# Altium project PCB2.PrjPcb
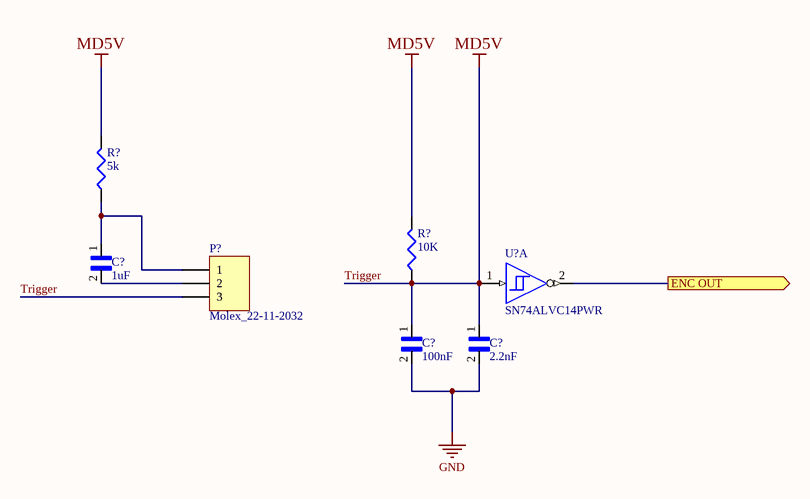
[diagram p0: Main Encoder.SchDoc]
9 sheets, 38 parts. Net scope: hierarchical (ports join the sheet entries above them; power ports are global).
Sheets:
  Main Encoder.SchDoc
  Top Level Hierarchy.SchDoc
    U_MCU Header = MCU Header.SchDoc
    U_CAN_Bus = CAN_Bus.SchDoc
    U_DAC = DAC.SchDoc
    U_LCD = LCD.SchDoc
    U_RS232 = RS232.SchDoc
    U_Servo Header = Servo Header.SchDoc
    U_Limit Switches = Limit Switches.SchDoc

## Sheet Main Encoder.SchDoc: Encoder
size B; Engineer: Kyle Dick; Revision: 1; SheetNumber: 12; SheetTotal: 12

### Parts
(Parts that share a designator on the sheet are numbered #1, #2 ... from top to bottom, then left to right.)
C?#1  1uF  [10 uF Cap]
C?#2  100nF  [10 uF Cap]
C?#3  2.2nF  [10 uF Cap]
P?#1  Molex_22-11-2032  [MOLEX_22-11-2032]
R?#1  5k  [RESC2112X05M]
R?#2  10K  [RESC2112X05M]
U?  SN74ALVC14PWR  [PW0014A_N]  (part A of 7)

### Ports
ENC OUT (out)

### Nets
GND: C?#2.2 C?#3.2
Trigger: C?#2.1 C?#3.1 P?#1.3 R?#1.2 R?#2.1 R?#2.2 U?.1(1A)  [also labelled MD5V]
NetC?#1_1: C?#1.1 P?#1.1 R?#1.1
NetC?#1_2: C?#1.2 P?#1.2
NetU?_2: U?.2(~{1Y}) ; port ENC OUT

### Notes on the sheet
- ESE
- is the sole property of ESE. Any reproduction
- The Information Contained in this drawing
- Schematic P/N and Name
- Sheet Name
- 850 Fountain St. S.
- Cambridge, ON N3H 0A8
- Canada
- Approved
- in part or in whole without the written
- permission of ESE is strictly prohibited.
- APPROVALS
- DATE
- Size
- Scale
- B
- NTS
- Bare PCB P/N
- Date
- Sheet
- Rev.
- Checked
- Created
- of

### Library data of the parts
C?#1 = Capacitor 1uF: Ceramic Capacitor 1210; MF: Samsung Electro-Mechanics; MP: CL32A106KBJNNNE; Check_prices: https://www.snapeda.com/parts/CL32A106KBJNNNE/Samsung%20Electro-Mechanics/view-part/3598300/?ref=eda; Value: *; SnapEDA_Link: https://www.snapeda.com/parts/CL32A106KBJNNNE/Samsung%20Electro-Mechanics/view-part/3598300/?ref=snap; Package: 1210 Samsung; Availability: Unavailable; Price: None; Supplier 1: Arrow Electronics; Supplier Part Number 1: CL32B105KCJNNNE
C?#2 = Capacitor 0.1uF: Ceramic Capacitor 1210; MF: Samsung Electro-Mechanics; MP: CL32A106KBJNNNE; Check_prices: https://www.snapeda.com/parts/CL32A106KBJNNNE/Samsung%20Electro-Mechanics/view-part/3598300/?ref=eda; Value: *; SnapEDA_Link: https://www.snapeda.com/parts/CL32A106KBJNNNE/Samsung%20Electro-Mechanics/view-part/3598300/?ref=snap; Package: 1210 Samsung; Availability: Unavailable; Price: None; Supplier 1: Mouser; Supplier Part Number 1: 80-C1210C104K1R
C?#3 = Capacitor 2.2nF: Ceramic Capacitor 1210; MF: Samsung Electro-Mechanics; MP: CL32A106KBJNNNE; Check_prices: https://www.snapeda.com/parts/CL32A106KBJNNNE/Samsung%20Electro-Mechanics/view-part/3598300/?ref=eda; Value: *; SnapEDA_Link: https://www.snapeda.com/parts/CL32A106KBJNNNE/Samsung%20Electro-Mechanics/view-part/3598300/?ref=snap; Package: 1210 Samsung; Availability: Unavailable; Price: None; Supplier 1: Mouser; Supplier Part Number 1: 80-C1210C222K1HAUTO
P?#1 = Molex_22-11-2032: CONN HEADER 3POS .100 VERT GOLD; MPN: 0022112032; PN: WM2701-ND; URL: http://www.digikey.ca/product-detail/en/0022112032/WM2701-ND
R?#1 = Resistor 5k: 5k 1206 smd; Supplier: Arrow Electronics; Supplier Part Number: RMCF1206FT10K0; Supplier 1: Arrow Electronics; Supplier Part Number 1: RMCF1206FT10K0
R?#2 = Resistor 10k: 10k 1206 smd; Supplier: Arrow Electronics; Supplier Part Number: RMCF1206FT10K0; Supplier 1: Arrow Electronics; Supplier Part Number 1: RMCF1206FT10K0
U? = CMP-1615-01048-3: Hex Schmitt-Trigger Inverter, PW0014A, LARGE T&R; Manufacturer: Texas Instruments; Schmitt Trigger: Yes; Technology Family: ALVC; VCC(Min)(V): 2.3; Output Drive (IOL/IOH)(Max)(mA): -24/24; ICC @ Nom Voltage(Max)(mA): 0.01; Input Type: TTL; Output Type: CMOS; tpd @ Nom Voltage(Max)(ns): 3.7,3.9,3.4; VCC(Max)(V): 3.6; Bits(#): 6; F @ Nom Voltage(Max)(Mhz): 100; Rating: Catalog; Voltage(Nom)(V): 2.5,2.7,3.3; Code_JEDEC: MO-153; Operating Temperature Range(C): -40 to 85; DatasheetVersion: SCES107H; PackageReference: PW0014A; Generic Part Number: SN74ALVC14

## Sheet Top Level Hierarchy.SchDoc: Top Level Design
size B; Date: 24-02-02; CheckedBy: Jude THibeault; Author: Kyle Dick; Engineer: Kyle DIck; Revision: 0; SheetNumber: 1; SheetTotal: 10
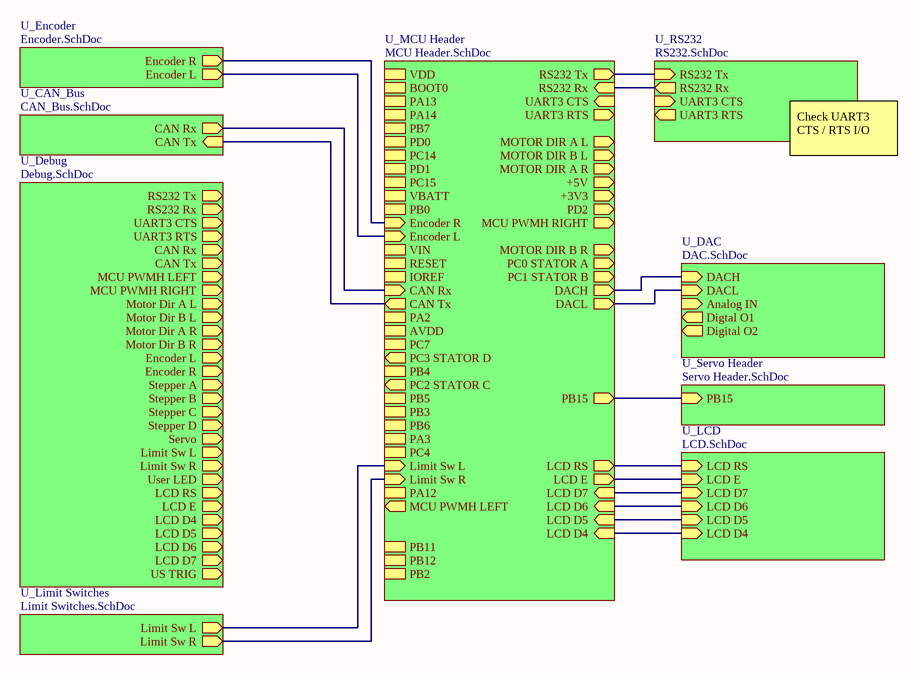
[diagram p1: Top Level Hierarchy.SchDoc]

### Sub-sheets
U_CAN_Bus = CAN_Bus.SchDoc: CAN Rx (out), CAN Tx (in)
U_DAC = DAC.SchDoc: DACH (in), DACL (in), Digtal O1 (out), Digital O2 (out), Analog IN (in)
U_Debug = Debug.SchDoc (file not in this document): RS232 Tx (out), RS232 Rx (out), UART3 CTS (out), UART3 RTS (out), CAN Rx (out), CAN Tx (out), MCU PWMH LEFT (out), MCU PWMH RIGHT (out), Motor Dir A L (out), Motor Dir B L (out), Motor Dir A R (out), Motor Dir B R (out), Encoder L (out), Encoder R (out), Stepper A (out), Stepper B (out), Stepper C (out), Stepper D (out), Servo (out), Limit Sw L (out), Limit Sw R (out), User LED (out), LCD RS (out), LCD E (out), LCD D4 (out), LCD D5 (out), LCD D6 (out), LCD D7 (out), US TRIG (out)
U_Encoder = Encoder.SchDoc (file not in this document): Encoder L (out), Encoder R (out)
U_LCD = LCD.SchDoc: LCD RS (in), LCD E (in), LCD D7 (in), LCD D6 (in), LCD D5 (in), LCD D4 (in)
U_Limit Switches = Limit Switches.SchDoc: Limit Sw L (out), Limit Sw R (out)
U_MCU Header = MCU Header.SchDoc: PC0 STATOR A (out), PC1 STATOR B (out), PC2 STATOR C (out), PC3 STATOR D (out), VDD, MCU PWMH LEFT (out), BOOT0, MOTOR DIR A L (out), PA13, PA14, PB7, MOTOR DIR B L (out), PD0, PC14, PD1, PC15, VBATT, PB0, Encoder R (in), Encoder L (in), VIN, +5V (out), +3V3 (out), RESET, IOREF, PD2 (out), MCU PWMH RIGHT (out), LCD D6 (in), PA2, CAN Tx (out), MOTOR DIR B R (out), AVDD, CAN Rx (in), LCD RS (out), PC7, LCD E (out), LCD D5 (in), PB4, LCD D4 (in), PB5, RS232 Tx (out), PB3, PB6, PA3, PC4, Limit Sw L (in), MOTOR DIR A R (out), Limit Sw R (in), PA12, LCD D7 (in), PB12, PB2, UART3 CTS (in), RS232 Rx (in), UART3 RTS (out), PB15 (out), PB11, DACL (out), DACH (out)
U_RS232 = RS232.SchDoc: RS232 Tx (in), RS232 Rx (out), UART3 CTS (in), UART3 RTS (out)
U_Servo Header = Servo Header.SchDoc: PB15 (in)

### Nets
IC5V: sheet U_MCU Header/LCD E, sheet U_LCD/LCD E
NetCRXD_2: sheet U_MCU Header/CAN Rx, sheet U_CAN_Bus/CAN Rx
NetP?#2_28: sheet U_MCU Header/Encoder L, sheet U_Encoder/Encoder L
NetP?#2_30: sheet U_MCU Header/Encoder R, sheet U_Encoder/Encoder R
NetP?#2_32: sheet U_MCU Header/DACL, sheet U_DAC/DACL
NetP?#3_4: sheet U_MCU Header/Limit Sw R, sheet U_Limit Switches/Limit Sw R
NetP?#3_5: sheet U_MCU Header/CAN Tx, sheet U_CAN_Bus/CAN Tx
NetP?#3_6: sheet U_MCU Header/Limit Sw L, sheet U_Limit Switches/Limit Sw L
NetP?#3_11: sheet U_MCU Header/DACH, sheet U_DAC/DACH
NetP?#3_13: sheet U_MCU Header/LCD RS, sheet U_LCD/LCD RS
NetP?#3_14: sheet U_MCU Header/LCD D7, sheet U_LCD/LCD D7
NetP?#3_21: sheet U_MCU Header/LCD D5, sheet U_LCD/LCD D5
NetP?#3_23: sheet U_MCU Header/LCD D4, sheet U_LCD/LCD D4
NetP?#3_24: sheet U_MCU Header/RS232 Rx, sheet U_RS232/RS232 Rx
NetP?#3_25: sheet U_MCU Header/RS232 Tx, sheet U_RS232/RS232 Tx
NetP?#3_26: sheet U_MCU Header/PB15, sheet U_Servo Header/PB15
NetP?#3_33: sheet U_MCU Header/LCD D6, sheet U_LCD/LCD D6

### Notes on the sheet
- Check UART3 CTS / RTS I/O
- ESE
- is the sole property of ESE. Any reproduction
- The Information Contained in this drawing
- Schematic P/N and Name
- Sheet Name
- 850 Fountain St. S.
- Cambridge, ON N3H 0A8
- Canada
- Approved
- in part or in whole without the written
- permission of ESE is strictly prohibited.
- APPROVALS
- DATE
- Size
- Scale
- B
- NTS
- Bare PCB P/N
- Date
- Sheet
- Rev.
- Checked
- Created
- of

## Sheet MCU Header.SchDoc: Nucleo Header Pin Assignment
size B; Date: 24-01-27; CheckedBy: Jude Thibeault; Author: Kyle Dick; DrawnBy: Kyle Dick; Engineer: Kyle Dick; Revision: 3; SheetNumber: 4; SheetTotal: 11
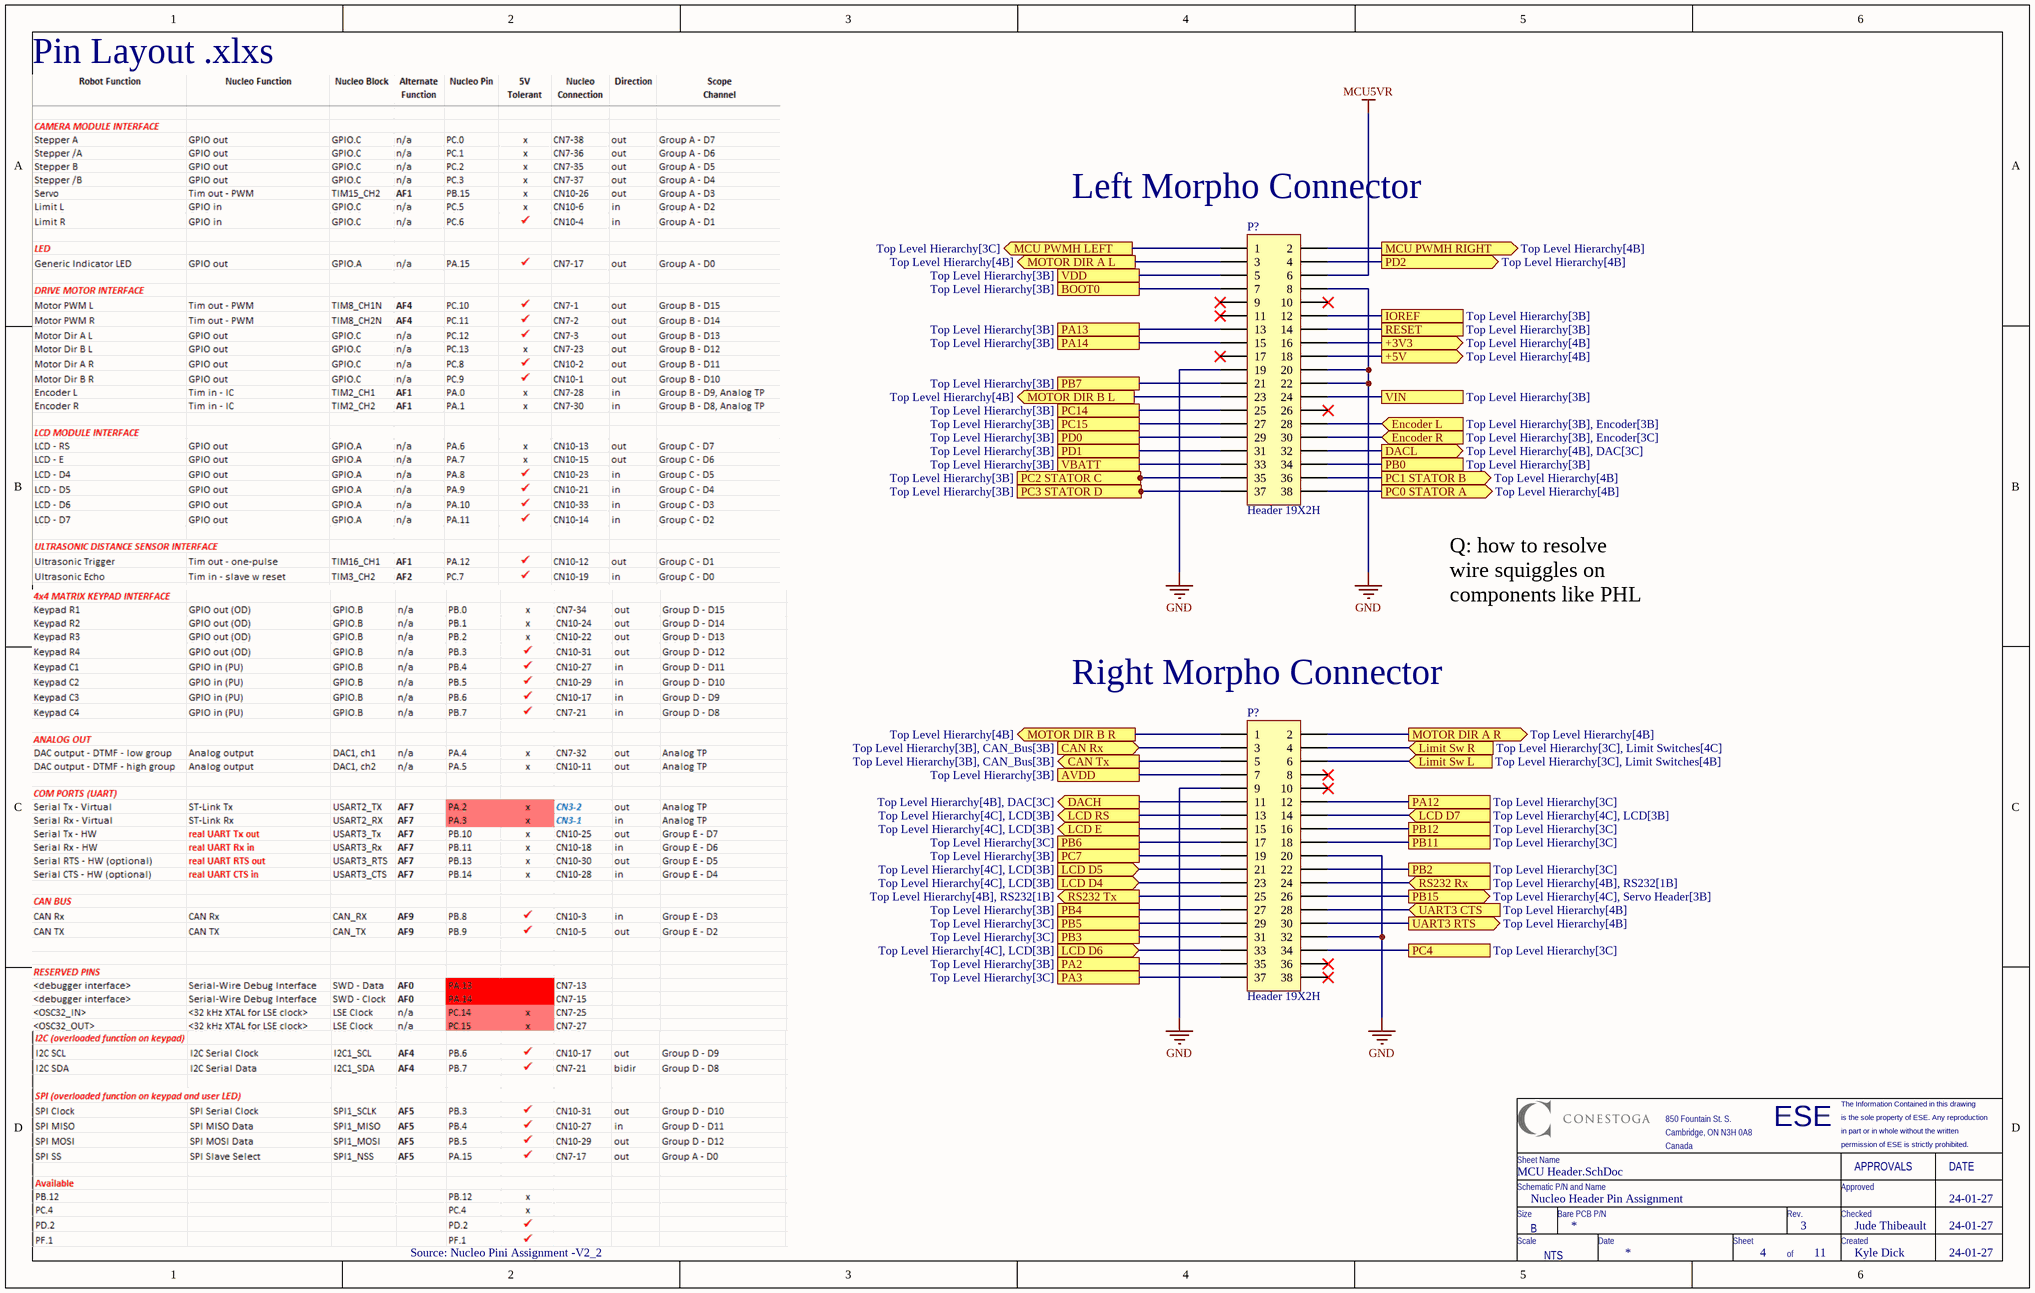
[diagram p2: MCU Header.SchDoc]

### Parts
(Parts that share a designator on the sheet are numbered #1, #2 ... from top to bottom, then left to right.)
P?#2  Header 19X2H  [Model Name]
P?#3  Header 19X2H  [PPPC192LFBN-RC]

### Ports
+3V3 (out, see Top Level Hierarchy[4B]), +5V (out, see Top Level Hierarchy[4B]), AVDD (see Top Level Hierarchy[3B]), BOOT0 (see Top Level Hierarchy[3B]), CAN Rx (in, see Top Level Hierarchy[3B], CAN_Bus[3B]), CAN Tx (out, see Top Level Hierarchy[3B], CAN_Bus[3B]), DACH (out, see Top Level Hierarchy[4B], DAC[3C]), DACL (out, see Top Level Hierarchy[4B], DAC[3C]), Encoder L (in, see Top Level Hierarchy[3B], Encoder[3B]), Encoder R (in, see Top Level Hierarchy[3B], Encoder[3C]), IOREF (see Top Level Hierarchy[3B]), LCD D4 (in, see Top Level Hierarchy[4C], LCD[3B]), LCD D5 (in, see Top Level Hierarchy[4C], LCD[3B]), LCD D6 (in, see Top Level Hierarchy[4C], LCD[3B]), LCD D7 (in, see Top Level Hierarchy[4C], LCD[3B]), LCD E (out, see Top Level Hierarchy[4C], LCD[3B]), LCD RS (out, see Top Level Hierarchy[4C], LCD[3B]), Limit Sw L (in, see Top Level Hierarchy[3C], Limit Switches[4B]), Limit Sw R (in, see Top Level Hierarchy[3C], Limit Switches[4C]), MCU PWMH LEFT (out, see Top Level Hierarchy[3C]), MCU PWMH RIGHT (out, see Top Level Hierarchy[4B]), MOTOR DIR A L (out, see Top Level Hierarchy[4B]), MOTOR DIR A R (out, see Top Level Hierarchy[4B]), MOTOR DIR B L (out, see Top Level Hierarchy[4B]), MOTOR DIR B R (out, see Top Level Hierarchy[4B]), PA2 (see Top Level Hierarchy[3B]), PA3 (see Top Level Hierarchy[3C]), PA12 (see Top Level Hierarchy[3C]), PA13 (see Top Level Hierarchy[3B]), PA14 (see Top Level Hierarchy[3B]), PB0 (see Top Level Hierarchy[3B]), PB2 (see Top Level Hierarchy[3C]), PB3 (see Top Level Hierarchy[3C]), PB4 (see Top Level Hierarchy[3B]), PB5 (see Top Level Hierarchy[3C]), PB6 (see Top Level Hierarchy[3C]), PB7 (see Top Level Hierarchy[3B]), PB11 (see Top Level Hierarchy[3C]), PB12 (see Top Level Hierarchy[3C]), PB15 (out, see Top Level Hierarchy[4C], Servo Header[3B]), PC0 STATOR A (out, see Top Level Hierarchy[4B]), PC1 STATOR B (out, see Top Level Hierarchy[4B]), PC2 STATOR C (out, see Top Level Hierarchy[3B]), PC3 STATOR D (out, see Top Level Hierarchy[3B]), PC4 (see Top Level Hierarchy[3C]), PC7 (see Top Level Hierarchy[3B]), PC14 (see Top Level Hierarchy[3B]), PC15 (see Top Level Hierarchy[3B]), PD0 (see Top Level Hierarchy[3B]), PD1 (see Top Level Hierarchy[3B]), PD2 (out, see Top Level Hierarchy[4B]), RESET (see Top Level Hierarchy[3B]), RS232 Rx (in, see Top Level Hierarchy[4B], RS232[1B]), RS232 Tx (out, see Top Level Hierarchy[4B], RS232[1B]), UART3 CTS (in, see Top Level Hierarchy[4B]), UART3 RTS (out, see Top Level Hierarchy[4B]), VBATT (see Top Level Hierarchy[3B]), VDD (see Top Level Hierarchy[3B]), VIN (see Top Level Hierarchy[3B])

### Nets
GND: P?#2.8 P?#2.19 P?#2.20 P?#2.22 P?#3.9 P?#3.20 P?#3.32
IC5V: P?#3.15 ; port LCD E
MCU5VR: P?#2.6
NetCRXD_2: P?#3.3 ; port CAN Rx
NetP?#2_1: P?#2.1 ; port MCU PWMH LEFT
NetP?#2_2: P?#2.2 ; port MCU PWMH RIGHT
NetP?#2_3: P?#2.3 ; port MOTOR DIR A L
NetP?#2_4: P?#2.4 ; port PD2
NetP?#2_5: P?#2.5 ; port VDD
NetP?#2_7: P?#2.7 ; port BOOT0
NetP?#2_12: P?#2.12 ; port IOREF
NetP?#2_13: P?#2.13 ; port PA13
NetP?#2_14: P?#2.14 ; port RESET
NetP?#2_15: P?#2.15 ; port PA14
NetP?#2_16: P?#2.16 ; port +3V3
NetP?#2_18: P?#2.18 ; port +5V
NetP?#2_21: P?#2.21 ; port PB7
NetP?#2_23: P?#2.23 ; port MOTOR DIR B L
NetP?#2_24: P?#2.24 ; port VIN
NetP?#2_25: P?#2.25 ; port PC14
NetP?#2_27: P?#2.27 ; port PC15
NetP?#2_28: P?#2.28 ; port Encoder L
NetP?#2_29: P?#2.29 ; port PD0
NetP?#2_30: P?#2.30 ; port Encoder R
NetP?#2_31: P?#2.31 ; port PD1
NetP?#2_32: P?#2.32 ; port DACL
NetP?#2_33: P?#2.33 ; port VBATT
NetP?#2_34: P?#2.34 ; port PB0
NetP?#2_35: P?#2.35 ; port PC2 STATOR C
NetP?#2_36: P?#2.36 ; port PC1 STATOR B
NetP?#2_37: P?#2.37 ; port PC3 STATOR D
NetP?#2_38: P?#2.38 ; port PC0 STATOR A
NetP?#3_1: P?#3.1 ; port MOTOR DIR B R
NetP?#3_2: P?#3.2 ; port MOTOR DIR A R
NetP?#3_4: P?#3.4 ; port Limit Sw R
NetP?#3_5: P?#3.5 ; port CAN Tx
NetP?#3_6: P?#3.6 ; port Limit Sw L
NetP?#3_7: P?#3.7 ; port AVDD
NetP?#3_11: P?#3.11 ; port DACH
NetP?#3_12: P?#3.12 ; port PA12
NetP?#3_13: P?#3.13 ; port LCD RS
NetP?#3_14: P?#3.14 ; port LCD D7
NetP?#3_16: P?#3.16 ; port PB12
NetP?#3_17: P?#3.17 ; port PB6
NetP?#3_18: P?#3.18 ; port PB11
NetP?#3_19: P?#3.19 ; port PC7
NetP?#3_21: P?#3.21 ; port LCD D5
NetP?#3_22: P?#3.22 ; port PB2
NetP?#3_23: P?#3.23 ; port LCD D4
NetP?#3_24: P?#3.24 ; port RS232 Rx
NetP?#3_25: P?#3.25 ; port RS232 Tx
NetP?#3_26: P?#3.26 ; port PB15
NetP?#3_27: P?#3.27 ; port PB4
NetP?#3_28: P?#3.28 ; port UART3 CTS
NetP?#3_29: P?#3.29 ; port PB5
NetP?#3_30: P?#3.30 ; port UART3 RTS
NetP?#3_31: P?#3.31 ; port PB3
NetP?#3_33: P?#3.33 ; port LCD D6
NetP?#3_34: P?#3.34 ; port PC4
NetP?#3_35: P?#3.35 ; port PA2
NetP?#3_37: P?#3.37 ; port PA3

Not connected (* = marked no-connect by the designer): P?#2 9* 10* 11* 17* 26*; P?#3 8* 10* 36* 38*

### Notes on the sheet
- Pin Layout .xlxs
- (near P?#2) Left Morpho Connector
- Q: how to resolve wire squiggles on components like PHL
- (near P?#3) Right Morpho Connector
- Source: Nucleo Pini Assignment -V2_2
- ESE
- is the sole property of ESE. Any reproduction
- The Information Contained in this drawing
- Schematic P/N and Name
- Sheet Name
- 850 Fountain St. S.
- Cambridge, ON N3H 0A8
- Canada
- Approved
- in part or in whole without the written
- permission of ESE is strictly prohibited.
- APPROVALS
- DATE
- Size
- Scale
- B
- NTS
- Bare PCB P/N
- Date
- Sheet
- Rev.
- Checked
- Created
- of

### Library data of the parts
P?#2 = Header 19X2H: 38 Position Header Connector 0.100in (2.54mm) Through Hole Gold; MPN: PPPC192LFBN-RC; PN: S7122-ND; URL: https://www.digikey.ca/product-detail/en/sullins-connector-solutions/PPPC192LFBN-RC/S7122-ND
P?#3 = Header 19X2H: 38 Position Header Connector 0.100in (2.54mm) Through Hole Gold; PN: S7122-ND; URL: https://www.digikey.ca/product-detail/en/sullins-connector-solutions/PPPC192LFBN-RC/S7122-ND; MPN: PPPC192LFBN-RC

## Sheet CAN_Bus.SchDoc: CAN BUS Transiever with MOLEX
size B; Date: 24-02-02; CheckedBy: Jude Thibeault; Author: Kyle Dick; DrawnBy: Kyle Dick; Engineer: Kyle Dick; Organization: Conestoga College; Revision: 3; SheetNumber: 6; SheetTotal: 9
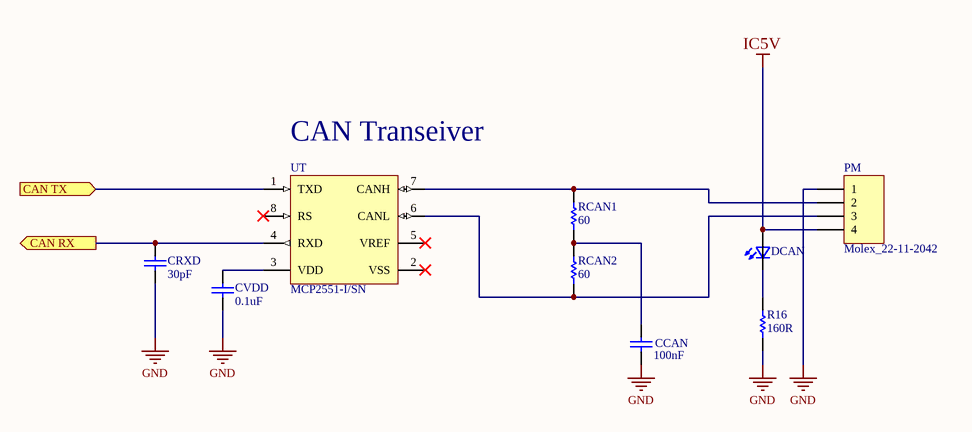
[diagram p3: CAN_Bus.SchDoc]

### Parts
CCAN  value 100nF  (hidden comment: Capacitor)
CRXD  value 30pF  (hidden comment: Capacitor)
CVDD  value 0.1uF  (hidden comment: Capacitor)
DCAN  LTST-S270KRKT  [0603]  (value not drawn)
PM  Molex_22-11-2042  [MOLEX-22-11-2042]
R16  value 160R  (hidden comment: Resistor)
RCAN1  value 60  (hidden comment: Resistor)
RCAN2  value 60  (hidden comment: Resistor)
UT  MCP2551-I/SN  [MCHP-SN8_V]

### Ports
CAN RX (out, see Top Level Hierarchy[3B]), CAN TX (in, see Top Level Hierarchy[3B])

### Nets
GND: CCAN.1 CRXD.1 CVDD.1 PM.1 R16.1
IC5V: DCAN.2(A2) PM.4
NetCCAN_2: CCAN.2 RCAN1.1 RCAN2.2
NetCRXD_2: CRXD.2 UT.4(RXD) ; port CAN RX
NetCVDD_2: CVDD.2 UT.3(VDD)
NetDCAN_1: DCAN.1(K2) R16.2
NetP?#3_5: UT.1(TXD) ; port CAN TX
NetPM_2: PM.2 RCAN1.2 UT.7(CANH)
NetPM_3: PM.3 RCAN2.1 UT.6(CANL)

Not connected (* = marked no-connect by the designer): UT 2(VSS)* 5(VREF)* 8(RS)*

### Notes on the sheet
- (near UT) CAN Transeiver
- ESE
- is the sole property of ESE. Any reproduction
- The Information Contained in this drawing
- Schematic P/N and Name
- Sheet Name
- 850 Fountain St. S.
- Cambridge, ON N3H 0A8
- Canada
- Approved
- in part or in whole without the written
- permission of ESE is strictly prohibited.
- APPROVALS
- DATE
- Size
- Scale
- B
- NTS
- Bare PCB P/N
- Date
- Sheet
- Rev.
- Checked
- Created
- of

### Library data of the parts
CCAN CRXD CVDD = Capacitor: SimulationGenericComponent: True
DCAN = LTST-S270KRKT: http://octopart.com/ltst-c190tbkt-lite-on-550003 / Blue LED; MF: {'manufacturer': u'Lite-On Inc.'}; Package: None; Price: None; Value: *; MP: LTST-S270KRKT; Availability: Unavailable
PM = Molex_22-11-2042: CONN HEADER 4POS .100 VERT GOLD; MPN: 0022112042; PN: WM2702-ND; URL: http://www.digikey.ca/product-detail/en/0022112042/WM2702-ND
R16 RCAN1 RCAN2 = Resistor: TC1: 0; SimulationGenericComponent: True; TC2: 0
UT = CMP-0186-00138-3: High-Speed CAN Transceiver, / 1 Mb/s, 4.5 to 5.5 V, 8-Pin SOIC (SN), Industrial Temperature, RoHS, Tube; Manufacturer: Microchip; RoHSCompliant: true; PackageReference: SN8; ComponentLink1URL: http://www.microchip.com/; DatasheetVersion: Rev. F, 07/2010; ComponentLink2Description: Datasheet; ComponentLink2URL: http://ww1.microchip.com/downloads/en/DeviceDoc/21667f.pdf; ComponentLink3Description: Package Specification; PackageDescription: 8-Pin Small Outline Integrated Circuit, Body 4.9 x 3.9 mm, Pitch 1.27 mm; ComponentLink1Description: Manufacturer URL; Mounting Technology: Surface Mount; ComponentLink3URL: http://www.microchip.com/stellent/groups/techpub_sg/documents/packagingspec/en012702.pdf

## Sheet DAC.SchDoc: DAC / ADC
size B; CheckedBy: Jude Thibeault; Engineer: Kyle Dick; Revision: 1; SheetNumber: 5; SheetTotal: 9
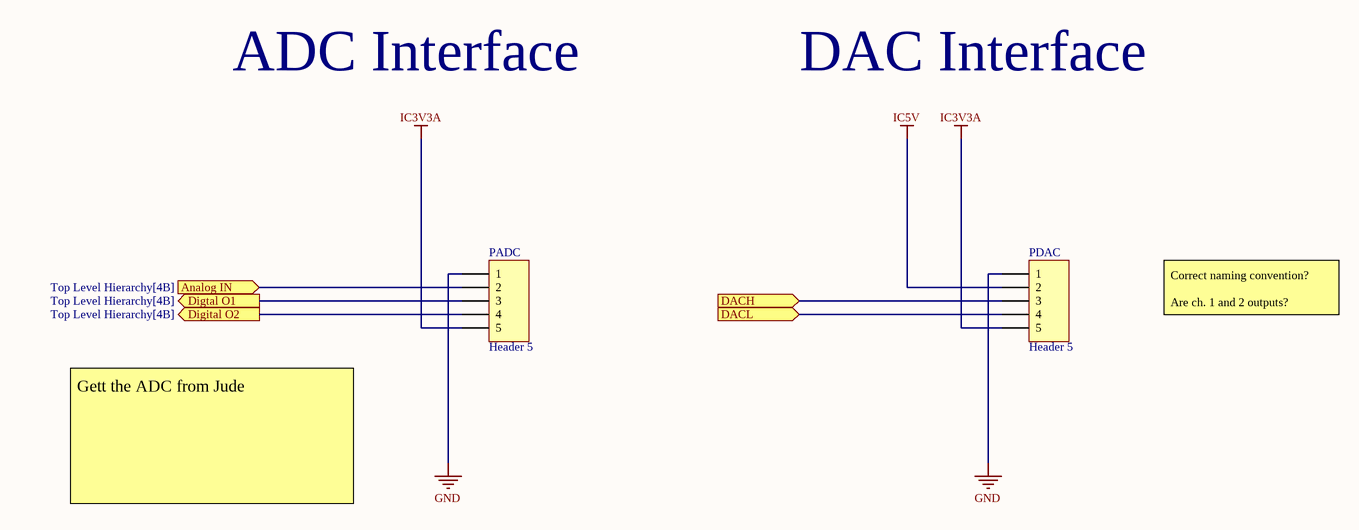
[diagram p4: DAC.SchDoc]

### Parts
PADC  Header 5  [HDR1X5]
PDAC  Header 5  [HDR1X5]

### Ports
Analog IN (in, see Top Level Hierarchy[4B]), DACH (in, see Top Level Hierarchy[4B]), DACL (in, see Top Level Hierarchy[4B]), Digital O2 (out, see Top Level Hierarchy[4B]), Digtal O1 (out, see Top Level Hierarchy[4B])

### Nets
GND: PADC.1 PDAC.1
IC3V3A: PADC.5 PDAC.5
IC5V: PDAC.2
NetP?#2_32: PDAC.4 ; port DACL
NetP?#3_11: PDAC.3 ; port DACH
NetPADC_2: PADC.2 ; port Analog IN
NetPADC_3: PADC.3 ; port Digtal O1
NetPADC_4: PADC.4 ; port Digital O2

### Notes on the sheet
- ADC Interface
- DAC Interface
- Correct naming convention?
  Are ch. 1 and 2 outputs?
- Gett the ADC from Jude
- ESE
- is the sole property of ESE. Any reproduction
- The Information Contained in this drawing
- Schematic P/N and Name
- Sheet Name
- 850 Fountain St. S.
- Cambridge, ON N3H 0A8
- Canada
- Approved
- in part or in whole without the written
- permission of ESE is strictly prohibited.
- APPROVALS
- DATE
- Size
- Scale
- B
- NTS
- Bare PCB P/N
- Date
- Sheet
- Rev.
- Checked
- Created
- of

### Library data of the parts
PADC PDAC = Header 5: Header, 5-Pin Male; MPN: PEC05SFAN; PN: S1212E-05-ND; URL: http://www.digikey.ca/product-detail/en/PEC05SFAN/S1212E-05-ND/859446

## Sheet LCD.SchDoc: LCD
size B; Date: 24-02-04; CheckedBy: Jude Thibeault; Author: Kyle Dick; Engineer: Kyle Dick; Revision: 1; SheetNumber: 3; SheetTotal: 9
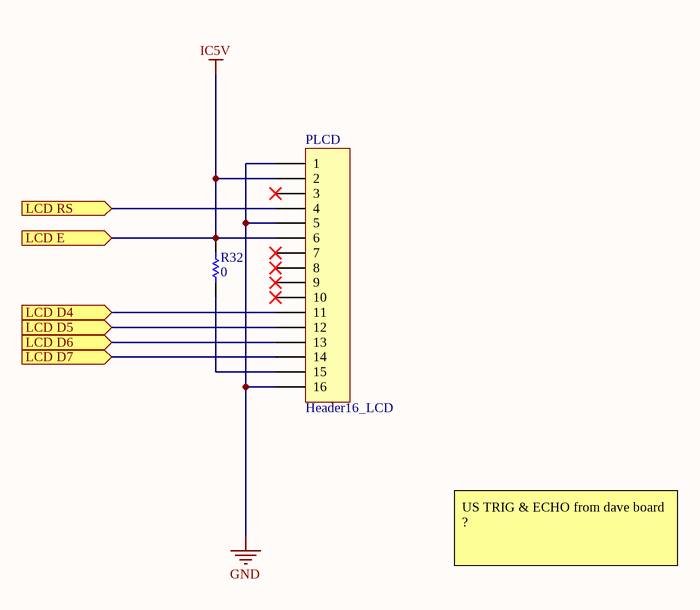
[diagram p5: LCD.SchDoc]

### Parts
PLCD  Header16_LCD  [HDR1X16_LCD]
R32  value 0  (hidden comment: Resistor)

### Ports
LCD D4 (in, see Top Level Hierarchy[4C], MCU Header[4C]), LCD D5 (in, see Top Level Hierarchy[4C], MCU Header[4C]), LCD D6 (in, see Top Level Hierarchy[4C], MCU Header[4C]), LCD D7 (in, see Top Level Hierarchy[4C], MCU Header[5C]), LCD E (in, see Top Level Hierarchy[4C], MCU Header[4C]), LCD RS (in, see Top Level Hierarchy[4C], MCU Header[4C])

### Nets
GND: PLCD.1 PLCD.5 PLCD.16
IC5V: PLCD.2 PLCD.6 R32.1 ; port LCD E
NetP?#3_13: PLCD.4 ; port LCD RS
NetP?#3_14: PLCD.14 ; port LCD D7
NetP?#3_21: PLCD.12 ; port LCD D5
NetP?#3_23: PLCD.11 ; port LCD D4
NetP?#3_33: PLCD.13 ; port LCD D6
NetPLCD_15: PLCD.15 R32.2

Not connected (* = marked no-connect by the designer): PLCD 3* 7* 8* 9* 10*

### Notes on the sheet
- US TRIG & ECHO from dave board ?
- ESE
- is the sole property of ESE. Any reproduction
- The Information Contained in this drawing
- Schematic P/N and Name
- Sheet Name
- 850 Fountain St. S.
- Cambridge, ON N3H 0A8
- Canada
- Approved
- in part or in whole without the written
- permission of ESE is strictly prohibited.
- APPROVALS
- DATE
- Size
- Scale
- B
- NTS
- Bare PCB P/N
- Date
- Sheet
- Rev.
- Checked
- Created
- of

### Library data of the parts
PLCD = Header16_LCD: Header, 16-Pin Female; MPN: PPPC161LFBN-RC; PN: S7049-ND; URL: http://www.digikey.ca/product-detail/en/PPPC161LFBN-RC/S7049-ND
R32 = Resistor: SimulationGenericComponent: True; TC1: 0; TC2: 0

## Sheet RS232.SchDoc: RS232 to DB9 Interface
size B; Date: 24-02-04; CheckedBy: Jude Thibeault; Author: Kyle Dick; DrawnBy: Kyle Dick; Engineer: Kyle Dick; Organization: Conestoga College; Revision: 3; SheetNumber: 2; SheetTotal: 9
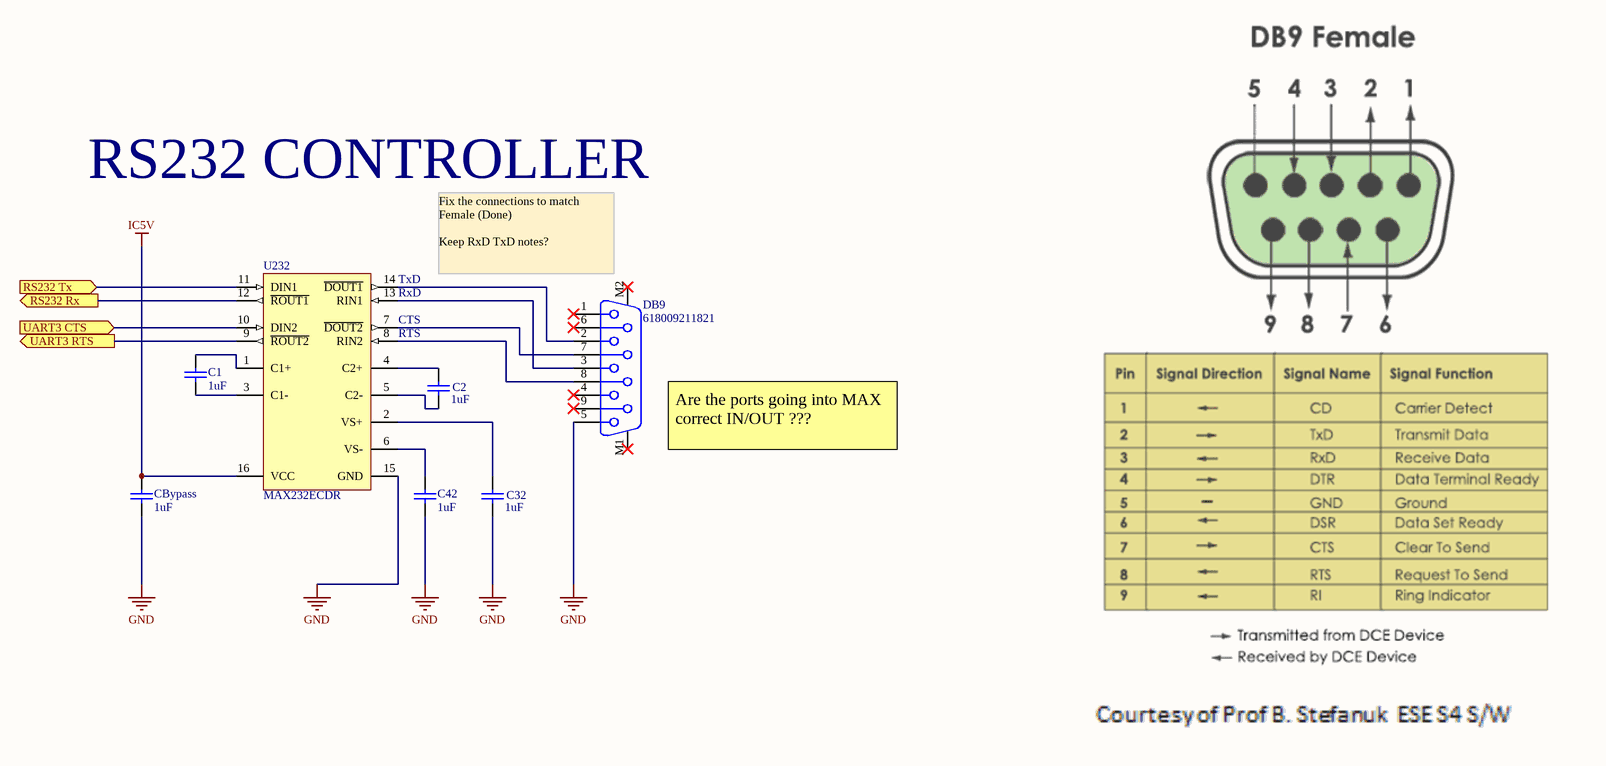
[diagram p6: RS232.SchDoc]

### Parts
C1  value 1uF  (hidden comment: Capacitor)
C2  value 1uF  (hidden comment: Capacitor)
C32  value 1uF  (hidden comment: Capacitor)
C42  value 1uF  (hidden comment: Capacitor)
CBypass  value 1uF  (hidden comment: Capacitor)
DB9  618009211821  [618009211821]
U232  MAX232ECDR  [D0016A_L]

### Ports
RS232 Rx (out, see Top Level Hierarchy[4B], MCU Header[5C]), RS232 Tx (in, see Top Level Hierarchy[4B], MCU Header[4C]), UART3 CTS (in, see Top Level Hierarchy[4B]), UART3 RTS (out, see Top Level Hierarchy[4B])

### Nets
GND: C32.1 C42.1 CBypass.1 DB9.5 U232.15(GND)
IC5V: CBypass.2 U232.16(VCC)
NetC1_1: C1.1 U232.3(C1-)
NetC1_2: C1.2 U232.1(C1+)
NetC2_1: C2.1 U232.5(C2-)
NetC2_2: C2.2 U232.4(C2+)
NetC32_2: C32.2 U232.2(VS+)
NetC42_2: C42.2 U232.6(VS-)
NetDB9_2: DB9.2 U232.14(~{DOUT1})
NetDB9_3: DB9.3 U232.13(RIN1)
NetDB9_7: DB9.7 U232.7(~{DOUT2})
NetDB9_8: DB9.8 U232.8(RIN2)
NetP?#3_24: U232.12(~{ROUT1}) ; port RS232 Rx
NetP?#3_25: U232.11(DIN1) ; port RS232 Tx
NetU232_9: U232.9(~{ROUT2}) ; port UART3 RTS
NetU232_10: U232.10(DIN2) ; port UART3 CTS

Not connected (* = marked no-connect by the designer): DB9 1* 4* 6* 9* M1* M2*

### Notes on the sheet
- RS232 CONTROLLER
- (near U232) RxD
- (near U232) TxD
- (near DB9) Fix the connections to match Female (Done)
  Keep RxD TxD notes?
- (near U232) CTS
- (near U232) RTS
- (near DB9) Are the ports going into MAX correct IN/OUT ???
- ESE
- is the sole property of ESE. Any reproduction
- The Information Contained in this drawing
- Schematic P/N and Name
- Sheet Name
- 850 Fountain St. S.
- Cambridge, ON N3H 0A8
- Canada
- Approved
- in part or in whole without the written
- permission of ESE is strictly prohibited.
- APPROVALS
- DATE
- Size
- Scale
- B
- NTS
- Bare PCB P/N
- Date
- Sheet
- Rev.
- Checked
- Created
- of

### Library data of the parts
C1 C2 C32 C42 CBypass = Capacitor: SimulationGenericComponent: True
DB9 = CMP-1502-00208-2: NexarPartId: 89205517; Insulation Resistance: 5GΩ; Current Rating: 3A; Contact Resistance: 30mΩ; Gender: Female; Operating Supply Voltage: 125V; Pitch: 2.77mm; Insulation Material: PBT; Contact Plating: Gold; Number of Pins: 9; RoHS: Compliant; Max Operating Temperature: 105°C; Length: 16.33mm; Min Operating Temperature: -55°C
U232 = CMP-0299-00610-2: Dual RS-232 Driver / Receiver with IEC61000-4-2 Protection, 0 to 70 degC, 16-Pin SOIC (D), Green (RoHS & no Sb/Br); IEC-61000-4-2 SUPPORT: TRUE; Supply Voltage(s)(V): 5; Receivers Per Package: 2; ESD HBM(kV): +/-15; ICC(Max)(mA): 10; ComponentLink3Description: Package Specification; PackageReference: D0016A; PackageVersion: revM, Jun-2011; ComponentLink2Description: Datasheet; PackageDescription: 16-Pin Plastic Small Outline Integrated Circuit, 9.9 x 3.9 mm, Pitch 1.27 mm Pitch; ComponentLink3URL: http://www.ti.com/litv/pdf/mpds178g; ComponentLink1Description: Manufacturer URL; Drivers Per Package: 2; DatasheetVersion: SLLS723B; ComponentLink2URL: http://www.ti.com/general/docs/lit/getliterature.tsp?genericPartNumber=MAX232E&fileType=pdf; RS-232: TRUE; SubFamily: RS-232; ComponentLink1URL: www.ti.com; Single Supply: TRUE

## Sheet Servo Header.SchDoc: Servo Connections
size B; Date: 24-02-02; CheckedBy: Jude Thibeault; Engineer: Kyle Dick; Revision: 2; SheetNumber: 7; SheetTotal: 9
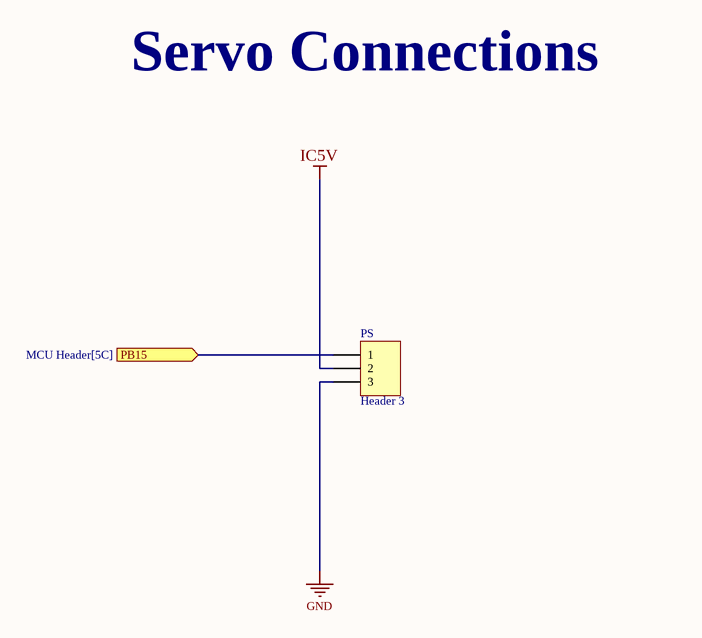
[diagram p7: Servo Header.SchDoc]

### Parts
PS  Header 3  [HDR1X3]

### Ports
PB15 (in, see MCU Header[5C])

### Nets
GND: PS.3
IC5V: PS.2
NetP?#3_26: PS.1 ; port PB15

### Notes on the sheet
- Servo Connections
- ESE
- is the sole property of ESE. Any reproduction
- The Information Contained in this drawing
- Schematic P/N and Name
- Sheet Name
- 850 Fountain St. S.
- Cambridge, ON N3H 0A8
- Canada
- Approved
- in part or in whole without the written
- permission of ESE is strictly prohibited.
- APPROVALS
- DATE
- Size
- Scale
- B
- NTS
- Bare PCB P/N
- Date
- Sheet
- Rev.
- Checked
- Created
- of

### Library data of the parts
PS = Header 3: Header, 3-Pin Male; MPN: PEC03SFAN; PN: S1212E-03-ND; URL: http://www.digikey.ca/product-detail/en/PEC03SFAN/S1212E-03-ND

## Sheet Limit Switches.SchDoc: Limit Switches
size B; Date: 24-02-04; CheckedBy: Jude Thibeault; Engineer: Kyle Dick; Revision: 1; SheetNumber: 2; SheetTotal: 3
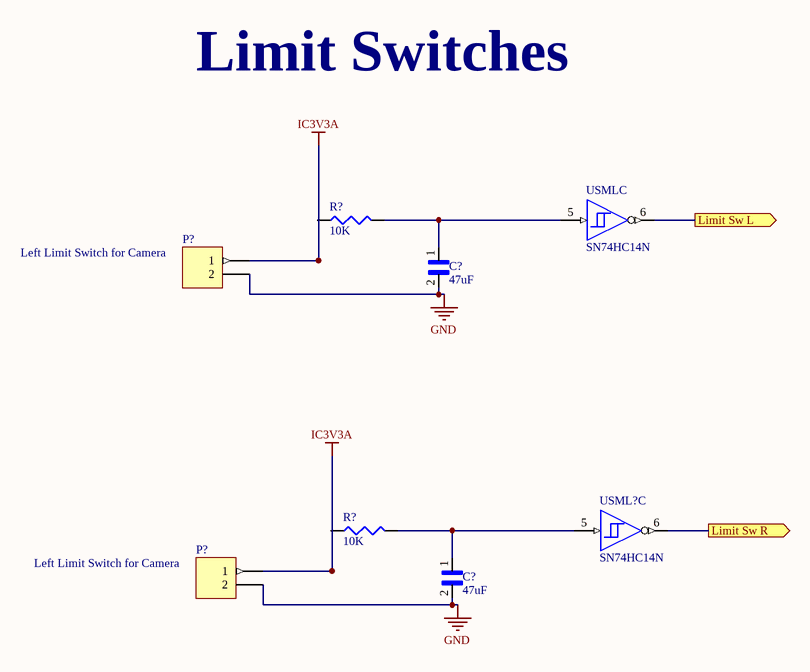
[diagram p8: Limit Switches.SchDoc]

### Parts
(Parts that share a designator on the sheet are numbered #1, #2 ... from top to bottom, then left to right.)
C?#4  47uF  [10 uF Cap]
C?#5  47uF  [10 uF Cap]
P?#4  (no value)  [ED1601-nd]
P?#5  (no value)  [ED1601-nd]
R?#3  10K  [RESC2112X05M]
R?#4  10K  [RESC2112X05M]
USML  SN74HC14N  [N0014A]  (part C of 7)
USML?  SN74HC14N  [N0014A]  (part C of 7)

### Ports
Limit Sw L (out), Limit Sw R (out)

### Nets
GND: C?#4.2 C?#5.2 P?#4.2 P?#5.2
IC3V3A: P?#4.1 P?#5.1
NetC?#4_1: C?#4.1 R?#3.2 USML.5(3A)
NetC?#5_1: C?#5.1 R?#4.2 USML?.5(3A)
NetP?#3_4: USML?.6(~{3Y}) ; port Limit Sw R
NetP?#3_6: USML.6(~{3Y}) ; port Limit Sw L

Not connected (* = marked no-connect by the designer): R?#3 1; R?#4 1

### Notes on the sheet
- Limit Switches
- (near P?#4) Left Limit Switch for Camera
- (near P?#5) Left Limit Switch for Camera
- ESE
- is the sole property of ESE. Any reproduction
- The Information Contained in this drawing
- Schematic P/N and Name
- Sheet Name
- 850 Fountain St. S.
- Cambridge, ON N3H 0A8
- Canada
- Approved
- in part or in whole without the written
- permission of ESE is strictly prohibited.
- APPROVALS
- DATE
- Size
- Scale
- B
- NTS
- Bare PCB P/N
- Date
- Sheet
- Rev.
- Checked
- Created
- of

### Library data of the parts
C?#4 C?#5 = Capacitor 47uF: Ceramic Capacitor 1210; MF: Samsung Electro-Mechanics; MP: CL32A106KBJNNNE; Check_prices: https://www.snapeda.com/parts/CL32A106KBJNNNE/Samsung%20Electro-Mechanics/view-part/3598300/?ref=eda; Value: *; SnapEDA_Link: https://www.snapeda.com/parts/CL32A106KBJNNNE/Samsung%20Electro-Mechanics/view-part/3598300/?ref=snap; Package: 1210 Samsung; Availability: Unavailable; Price: None; Supplier 1: Mouser; Supplier Part Number 1: 81-GRM32EC81C476KE5K
P?#4 P?#5 = Header 2: Header, 2-Pin; LatestRevisionDate: 17-Jul-2002; LatestRevisionNote: Re-released for DXP Platform.; Publisher: Altium Limited
R?#3 R?#4 = Resistor 10k: 10k 1206 smd; Supplier: Arrow Electronics; Supplier Part Number: RMCF1206FT10K0; Supplier 1: Arrow Electronics; Supplier Part Number 1: RMCF1206FT10K0
USML USML? = CMP-1615-00889-3: Hex Schmitt-Trigger Inverters, N0014A, TUBE; Manufacturer: Texas Instruments; Input Type: CMOS; Voltage(Nom)(V): 5; VCC(Min)(V): 2; tpd @ Nom Voltage(Max)(ns): 31; Technology Family: HC; VCC(Max)(V): 6; F @ Nom Voltage(Max)(Mhz): 20; Output Drive (IOL/IOH)(Max)(mA): -4/4; Rating: Catalog; Schmitt Trigger: Yes; ICC @ Nom Voltage(Max)(mA): 0.02; PackageReference: N0014A; Code_JEDEC: MS-001; Operating Temperature Range(C): -40 to 85; Generic Part Number: SN74HC14; Bits(#): 6; DatasheetVersion: SCLS085G; Output Type: CMOS

## Nets that join several sheets
GND: Main Encoder (C?#2.2 C?#3.2), MCU Header (7 pins), CAN_Bus (5 pins), DAC (PADC.1 PDAC.1), LCD (PLCD.1 PLCD.5 PLCD.16), RS232 (5 pins), Servo Header (PS.3), Limit Switches (C?#4.2 C?#5.2 P?#4.2 P?#5.2)
IC3V3A: DAC (PADC.5 PDAC.5), Limit Switches (P?#4.1 P?#5.1)
IC5V: MCU Header (P?#3.15), CAN_Bus (DCAN.2 PM.4), DAC (PDAC.2), LCD (PLCD.2 PLCD.6 R32.1), RS232 (CBypass.2 U232.16), Servo Header (PS.2)
NetCRXD_2: MCU Header (P?#3.3), CAN_Bus (CRXD.2 UT.4)
NetP?#2_32: MCU Header (P?#2.32), DAC (PDAC.4)
NetP?#3_4: MCU Header (P?#3.4), Limit Switches (USML?.6)
NetP?#3_5: MCU Header (P?#3.5), CAN_Bus (UT.1)
NetP?#3_6: MCU Header (P?#3.6), Limit Switches (USML.6)
NetP?#3_11: MCU Header (P?#3.11), DAC (PDAC.3)
NetP?#3_13: MCU Header (P?#3.13), LCD (PLCD.4)
NetP?#3_14: MCU Header (P?#3.14), LCD (PLCD.14)
NetP?#3_21: MCU Header (P?#3.21), LCD (PLCD.12)
NetP?#3_23: MCU Header (P?#3.23), LCD (PLCD.11)
NetP?#3_24: MCU Header (P?#3.24), RS232 (U232.12)
NetP?#3_25: MCU Header (P?#3.25), RS232 (U232.11)
NetP?#3_26: MCU Header (P?#3.26), Servo Header (PS.1)
NetP?#3_33: MCU Header (P?#3.33), LCD (PLCD.13)